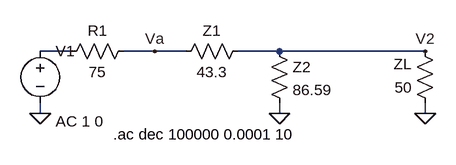
[diagram p0: schematic ts14-ej2.asc]
ts14-ej2.asc, the LTspice schematic file:
Version 4
SHEET 1 880 680
WIRE -160 128 -208 128
WIRE -32 128 -80 128
WIRE 16 128 -32 128
WIRE 160 128 96 128
WIRE 384 128 160 128
WIRE -208 224 -208 208
WIRE 160 224 160 208
WIRE 384 224 384 208
FLAG 160 224 0
FLAG 384 224 0
FLAG -208 224 0
FLAG 384 128 V2
FLAG -32 128 Va
SYMBOL res 112 112 R90
WINDOW 0 0 56 VBottom 2
WINDOW 3 32 56 VTop 2
SYMATTR InstName Z1
SYMATTR Value 43.3
SYMBOL res 144 112 R0
SYMATTR InstName Z2
SYMATTR Value 86.59
SYMBOL res 400 224 R180
WINDOW 0 36 76 Left 2
WINDOW 3 36 40 Left 2
SYMATTR InstName ZL
SYMATTR Value 50
SYMBOL voltage -208 112 R0
WINDOW 123 24 124 Left 2
WINDOW 39 0 0 Left 0
SYMATTR Value2 AC 1 0
SYMATTR InstName V1
SYMATTR Value ""
SYMBOL res -64 112 R90
WINDOW 0 0 56 VBottom 2
WINDOW 3 32 56 VTop 2
SYMATTR InstName R1
SYMATTR Value 75
TEXT -96 256 Left 2 !.ac dec 100000 0.0001 10

The netlist it stands for:
* ts14-ej2.asc
R§Z1 V2 Va 43.3
R§Z2 V2 0 86.59
R§ZL 0 V2 50
V1 N001 0 AC 1 0
R1 Va N001 75
.ac dec 100000 0.0001 10
.backanno
.end